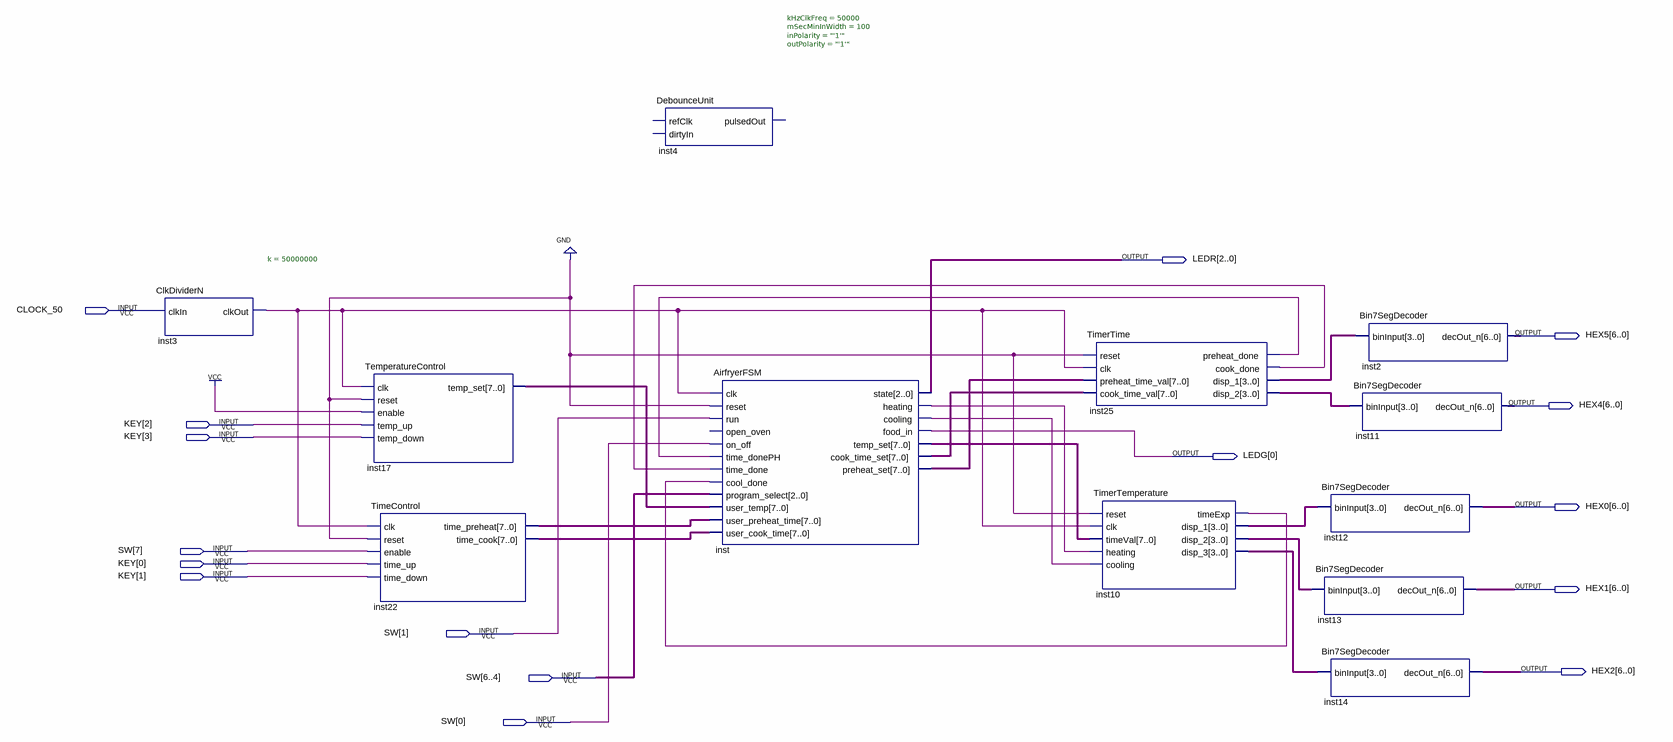
[diagram p0: schematic sheet]
// Quartus schematic demo.bdf as structural Verilog: 12 symbols, 16 pins
module demo (
  input  CLOCK_50,
  input  [3:0] KEY,
  input  [7:0] SW,
  output [2:0] LEDR,
  output [6:0] HEX5,
  output [6:0] HEX4,
  output [0:0] LEDG,
  output [6:0] HEX0,
  output [6:0] HEX1,
  output [6:0] HEX2
);

  wire inst3_clkout, inst10_timeexp, inst25_cook_done, inst25_preheat_done, inst_cooling, inst_heating;
  wire [3:0] inst10_disp_1, inst10_disp_2, inst10_disp_3, inst25_disp_1, inst25_disp_2;
  wire [7:0] inst17_temp_set, inst22_time_cook, inst22_time_preheat, inst_cook_time_set, inst_preheat_set,
       inst_temp_set;

  ClkDividerN #(.k(50000000)) inst3 (.clkIn(CLOCK_50), .clkOut(inst3_clkout));
  TemperatureControl inst17 (
    .clk(inst3_clkout), .reset(1'b0), .enable(1'b1), .temp_up(KEY[2]), .temp_down(KEY[3]),
    .temp_set(inst17_temp_set));
  TimeControl inst22 (
    .clk(inst3_clkout), .reset(1'b0), .enable(SW[7]), .time_up(KEY[0]), .time_down(KEY[1]),
    .time_preheat(inst22_time_preheat), .time_cook(inst22_time_cook));
  DebounceUnit #(.kHzClkFreq(50000), .mSecMinInWidth(100), .inPolarity("'1'"), .outPolarity("'1'")) inst4 ();  // open: refClk, dirtyIn, pulsedOut
  AirfryerFSM inst (
    .clk(inst3_clkout), .reset(1'b0), .run(SW[1]), .on_off(SW[0]), .time_donePH(inst25_preheat_done),
    .time_done(inst25_cook_done), .cool_done(inst10_timeexp), .program_select(SW[6:4]),
    .user_temp(inst17_temp_set), .user_preheat_time(inst22_time_preheat), .user_cook_time(inst22_time_cook),
    .state(LEDR), .heating(inst_heating), .cooling(inst_cooling), .food_in(LEDG[0]),
    .temp_set(inst_temp_set), .cook_time_set(inst_cook_time_set), .preheat_set(inst_preheat_set));  // open: open_oven
  TimerTime inst25 (
    .reset(1'b0), .clk(inst3_clkout), .preheat_time_val(inst_preheat_set),
    .cook_time_val(inst_cook_time_set), .preheat_done(inst25_preheat_done), .cook_done(inst25_cook_done),
    .disp_1(inst25_disp_1), .disp_2(inst25_disp_2));
  TimerTemperature inst10 (
    .reset(1'b0), .clk(inst3_clkout), .timeVal(inst_temp_set), .heating(inst_heating),
    .cooling(inst_cooling), .timeExp(inst10_timeexp), .disp_1(inst10_disp_1), .disp_2(inst10_disp_2),
    .disp_3(inst10_disp_3));
  Bin7SegDecoder inst2 (.binInput(inst25_disp_1), .decOut_n(HEX5));
  Bin7SegDecoder inst11 (.binInput(inst25_disp_2), .decOut_n(HEX4));
  Bin7SegDecoder inst12 (.binInput(inst10_disp_1), .decOut_n(HEX0));
  Bin7SegDecoder inst13 (.binInput(inst10_disp_2), .decOut_n(HEX1));
  Bin7SegDecoder inst14 (.binInput(inst10_disp_3), .decOut_n(HEX2));
endmodule
